# Altium schematic sheet DeltaSigma12.SchDoc: LiveDesign Evaluation - Wave Player
size A4; Organization: Altium Limited; Address1: L3, 12a Rodborough Rd; Address2: Frenchs Forest; Address3: NSW; Address4: Australia 2086; DocumentNumber: 3; SheetNumber: 3; SheetTotal: 3
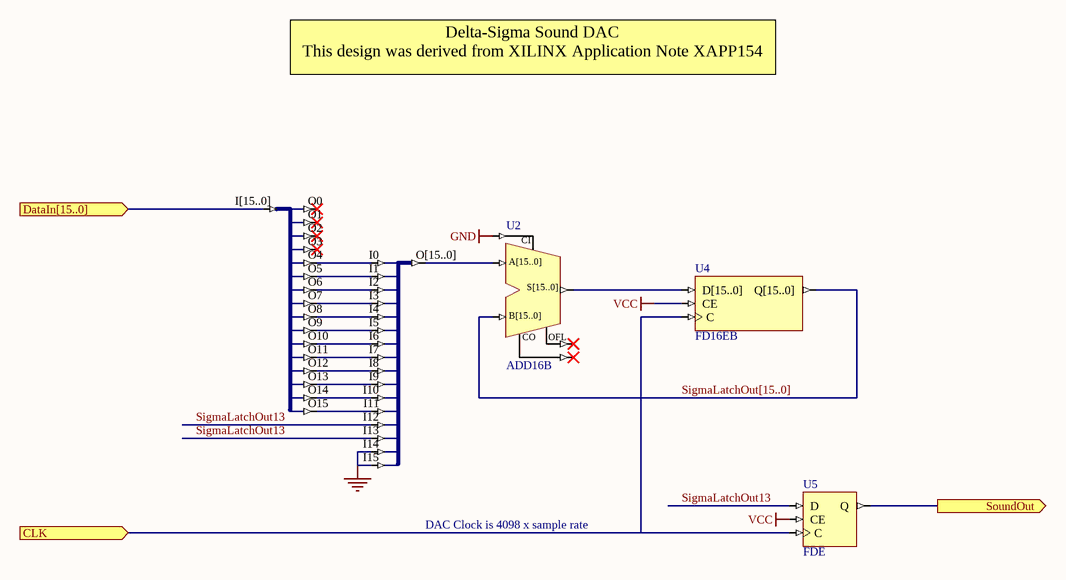
[diagram p0: DeltaSigma12.SchDoc]

## Parts
U1  J16B_16S  (value not drawn)
U2  ADD16B
U3  J16S_16B  (value not drawn)
U4  FD16EB
U5  FDE

## Ports
CLK (in), DataIn[15..0] (in), SoundOut (out)

## Nets
GND: U2.CI U3.I14 U3.I15
VCC: U4.CE U5.CE
CLK: U4.C U5.C ; port CLK
DataIn[15..0]: U1.I[15..0] ; port DataIn[15..0]
SigmaLatchOut13: U3.I12 U3.I13 U5.D
SigmaLatchOut[15..0]: U2.B[15..0] U4.Q[15..0]
SoundOut: U5.Q ; port SoundOut
NetU1_O4: U1.O4 U3.I0
NetU1_O5: U1.O5 U3.I1
NetU1_O6: U1.O6 U3.I2
NetU1_O7: U1.O7 U3.I3
NetU1_O8: U1.O8 U3.I4
NetU1_O9: U1.O9 U3.I5
NetU1_O10: U1.O10 U3.I6
NetU1_O11: U1.O11 U3.I7
NetU1_O12: U1.O12 U3.I8
NetU1_O13: U1.O13 U3.I9
NetU1_O14: U1.O14 U3.I10
NetU1_O15: U1.O15 U3.I11
NetU2_A[15..0]: U2.A[15..0] U3.O[15..0]
NetU2_S[15..0]: U2.S[15..0] U4.D[15..0]

Not connected (* = marked no-connect by the designer): U1 O0* O1* O2* O3*; U2 CO* OFL*

## Buses and harness runs
bus SigmaLatchOut[15..0]

## Notes on the sheet
- Delta-Sigma Sound DAC
  This design was derived from XILINX Application Note XAPP154
- DAC Clock is 4098 x sample rate
- Title
- Size:
- Date:
- A4
- Number:
- Time:
- Revision:
- Sheet
- of
- File:

## Library data of the parts
U1 = J16B_16S: Single 16-Bit input bus to 16 single pin outputs; ArchiveName: GENERIC; VHDLIB_SIM: GENERIC_LIB; Published: 29-Jan-2004; Publisher: Altium Limited; Core Revision: 1.00.00
U2 = ADD16B: 16-Bit Cascadable Full Adder with Signed and Unsigned Operations, Bus Version; Xilinx Equivalent: ADD16; ArchiveName: GENERIC; VHDLIB_SIM: GENERIC_LIB; Published: 29-Jan-2004; Publisher: Altium Limited; Core Revision: 1.00.00
U3 = J16S_16B: 16 Single pin inputs to single 16-Bit output bus; ArchiveName: GENERIC; VHDLIB_SIM: GENERIC_LIB; Published: 29-Jan-2004; Publisher: Altium Limited; Core Revision: 1.00.00
U4 = FD16EB: 16-Bit D Flip-Flop with Clock Enable, Bus Version; ArchiveName: GENERIC; VHDLIB_SIM: GENERIC_LIB; Published: 29-Jan-2004; Publisher: Altium Limited; Core Revision: 1.00.00
U5 = FDE: D Flip-Flop with Clock Enable; ArchiveName: GENERIC; VHDLIB_SIM: GENERIC_LIB; Published: 29-Jan-2004; Publisher: Altium Limited; Core Revision: 1.00.00